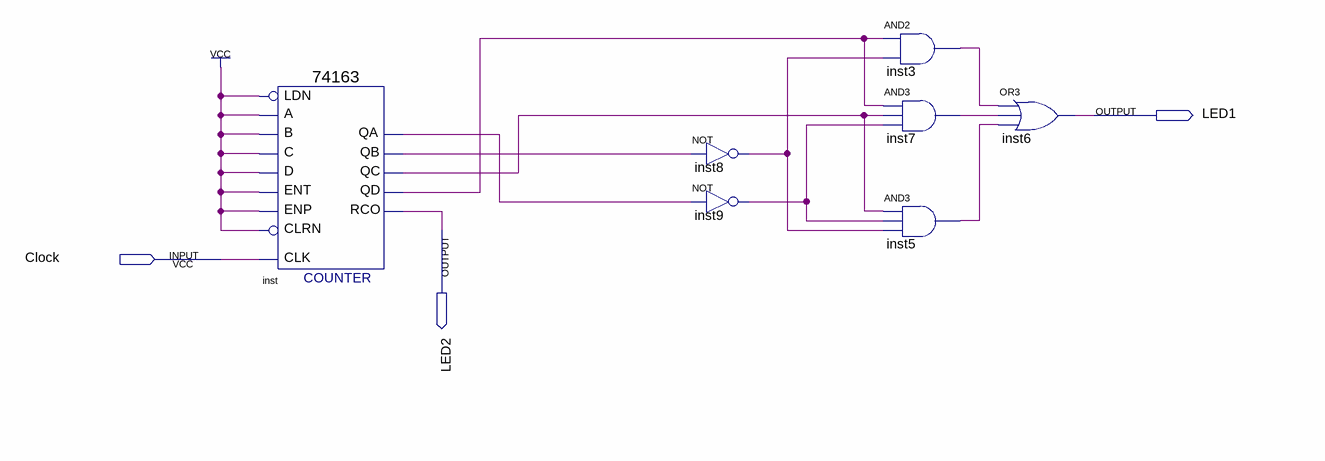
[diagram p0: schematic sheet]
// Quartus schematic q5.bdf as structural Verilog: 7 symbols, 3 pins
module q5 (
  input  Clock,
  output LED1,
  output LED2
);

  wire inst3_out, inst5_out, inst7_out, inst8_out, inst9_out, inst_qa, inst_qb, inst_qc, inst_qd;

  \74163  inst (
    .C(1'b1), .B(1'b1), .A(1'b1), .ENT(1'b1), .D(1'b1), .CLRN(1'b1), .CLK(Clock), .ENP(1'b1), .LDN(1'b1),
    .QA(inst_qa), .QB(inst_qb), .QC(inst_qc), .QD(inst_qd), .RCO(LED2));
  not inst8 (inst8_out, inst_qb);
  not inst9 (inst9_out, inst_qa);
  and inst3 (inst3_out, inst_qd, inst8_out);
  and inst7 (inst7_out, inst_qd, inst_qc, inst9_out);
  and inst5 (inst5_out, inst_qc, inst9_out, inst8_out);
  or inst6 (LED1, inst3_out, inst7_out, inst5_out);
endmodule
